# EAGLE design DraginoGateway2 (EAGLE 5.11)
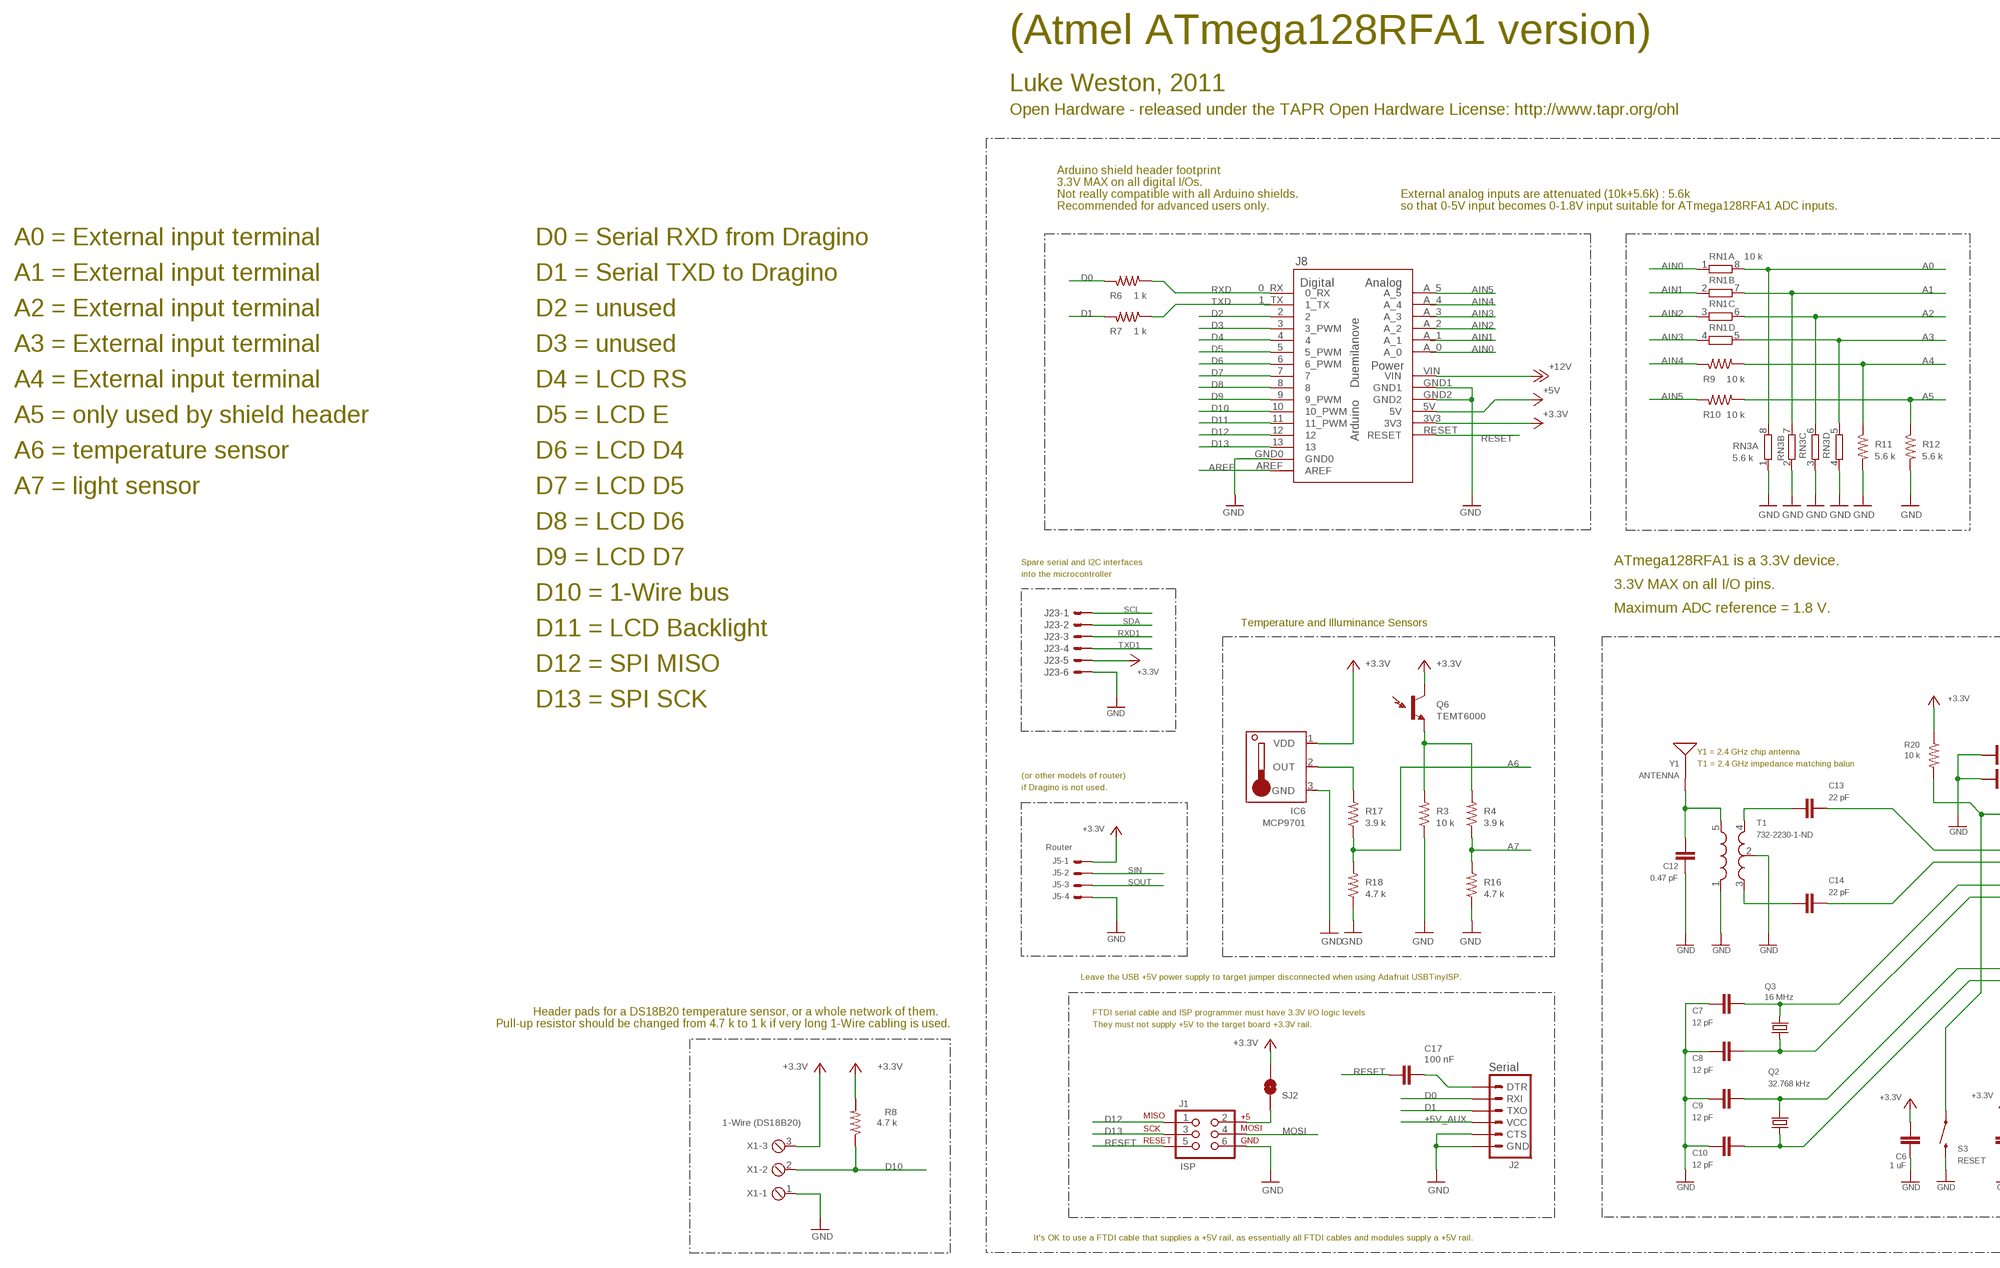
[diagram p0: schematic, sheet 1, part 1 of 2]
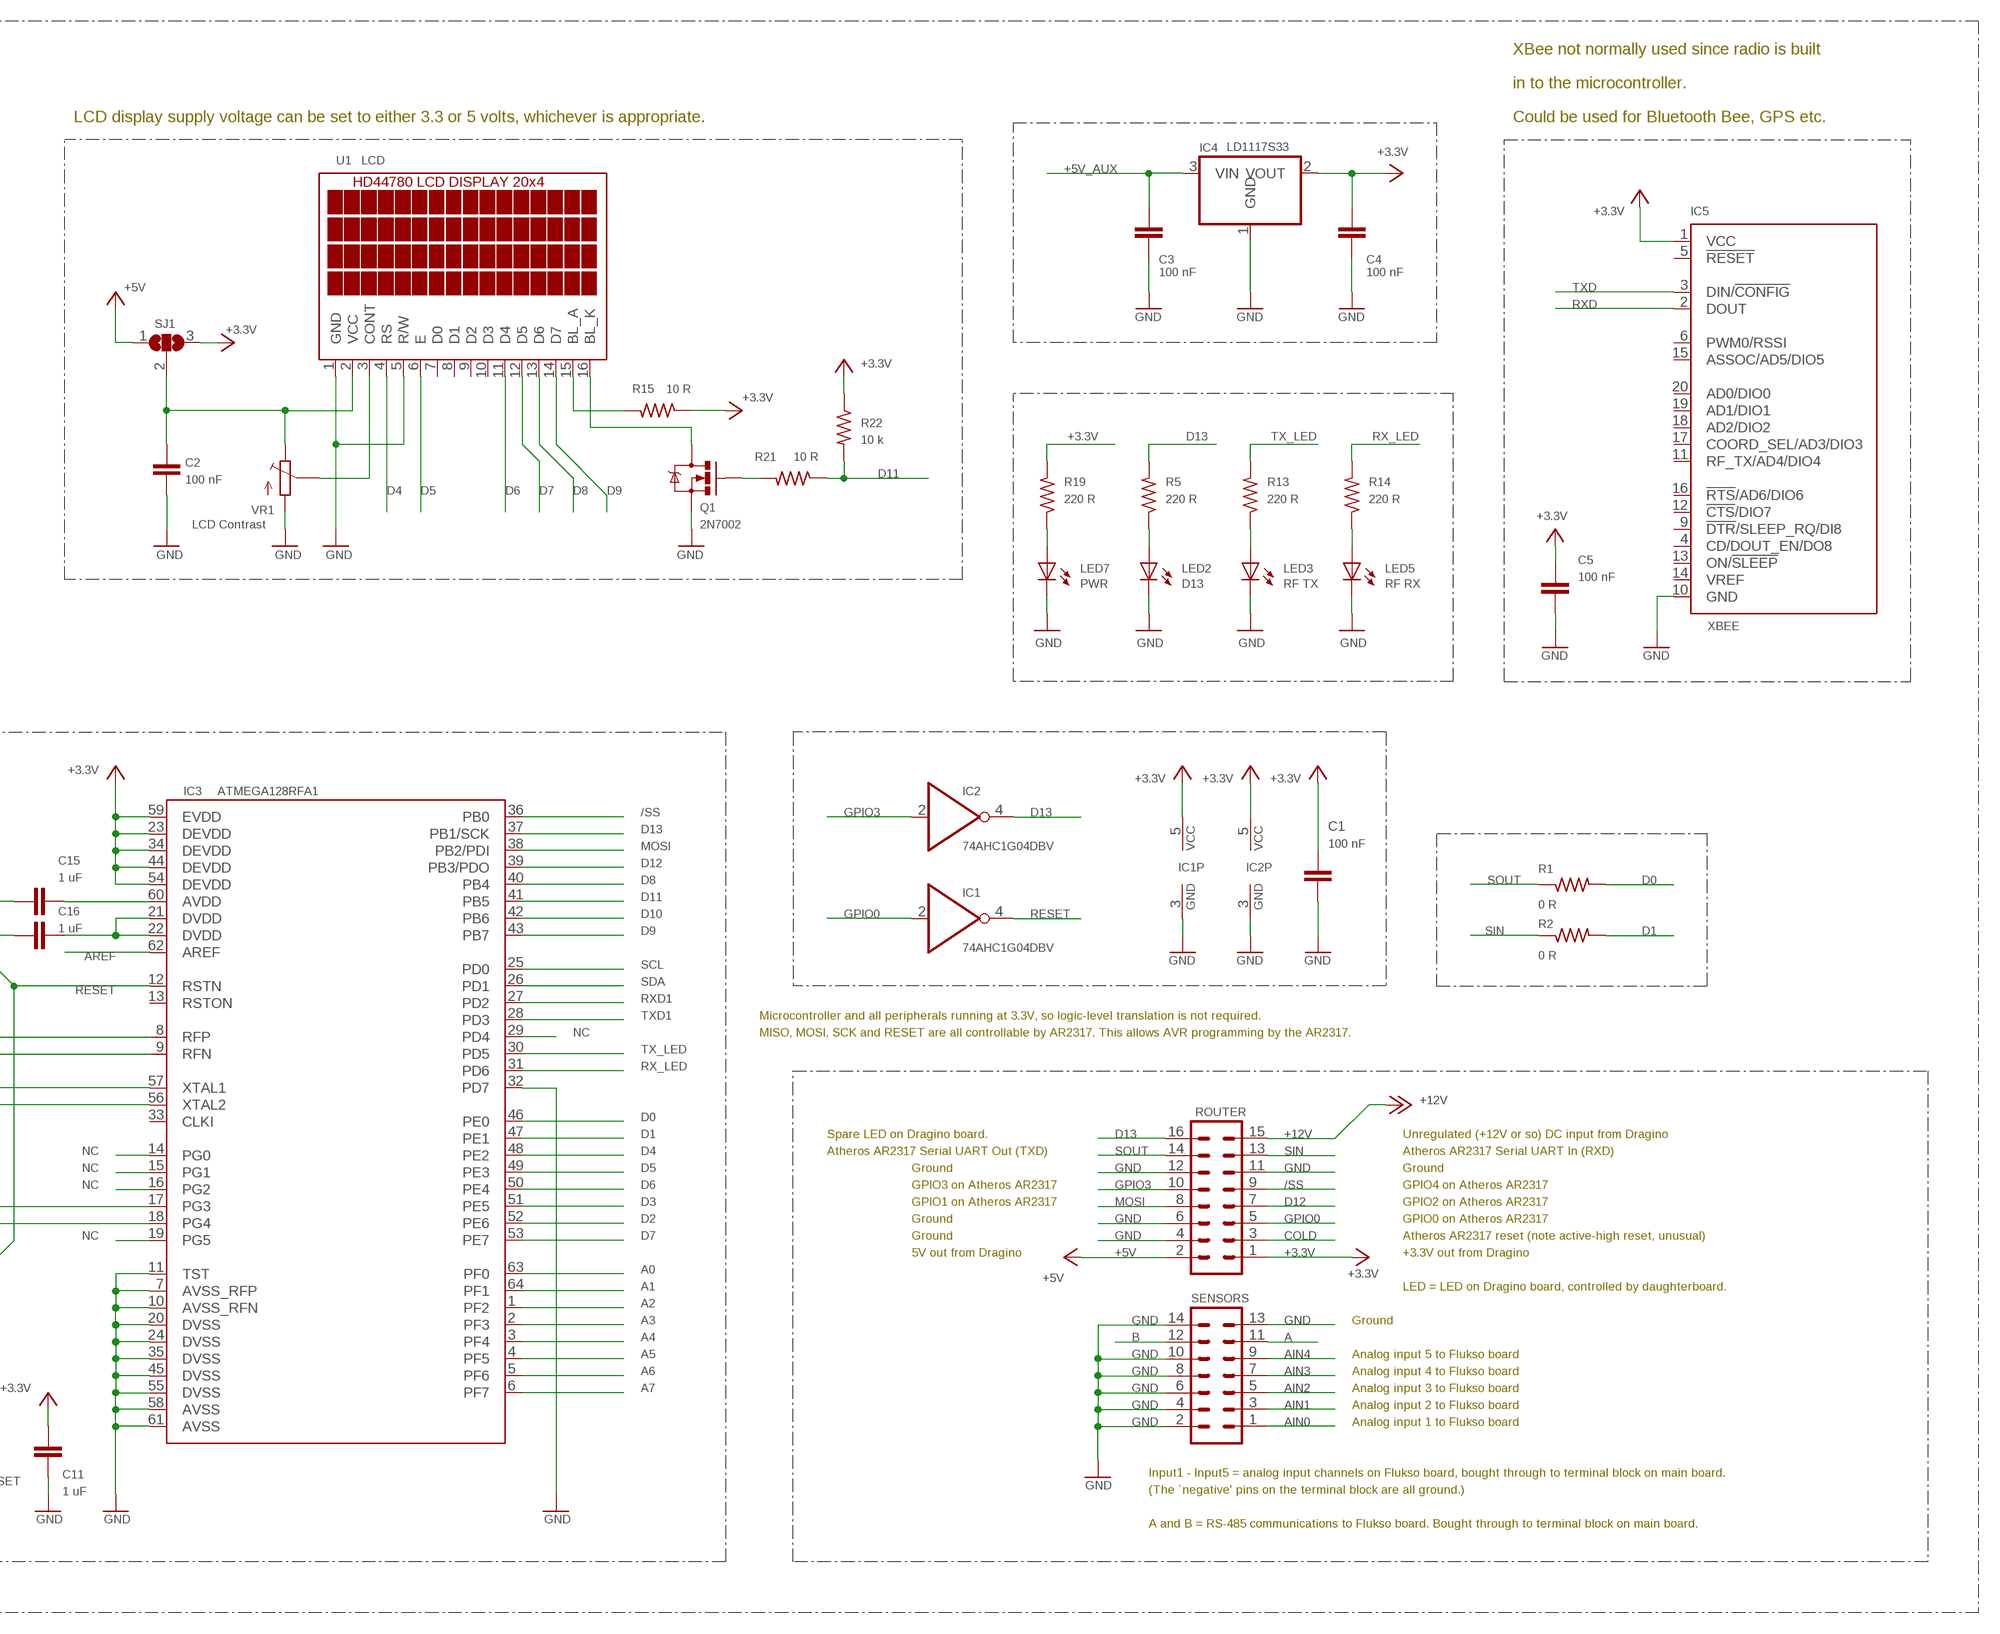
[diagram p1: schematic, sheet 1, part 2 of 2]

## Parts
C1  100 nF  C-EUC0805K  [C0805K]
C2  100 nF  C-EUC0805K  [C0805K]
C3  100 nF  C-EUC0805K  [C0805K]
C4  100 nF  C-EUC0805K  [C0805K]
C5  100 nF  C-EUC0805K  [C0805K]
C6  1 uF  C-EUC0805K  [C0805K]
C7  12 pF  C-EUC0805K  [C0805K]
C8  12 pF  C-EUC0805K  [C0805K]
C9  12 pF  C-EUC0805K  [C0805K]
C10  12 pF  C-EUC0805K  [C0805K]
C11  1 uF  C-EUC0805K  [C0805K]
C12  0.47 pF  C-EUC0603K  [C0603K]
C13  22 pF  C-EUC0603K  [C0603K]
C14  22 pF  C-EUC0603K  [C0603K]
C15  1 uF  C-EUC0805K  [C0805K]
C16  1 uF  C-EUC0805K  [C0805K]
C17  100 nF  C-EUC0805K  [C0805K]
IC1  74AHC1G04DBV  [SOT23-5]
IC2  74AHC1G04DBV  [SOT23-5]
IC3  ATMEGA128RFA1  [QFN-64]
IC4  LD1117S33  REG1117  [SOT223]
IC5  XBEE  [XBEE-PRO]
IC6  MCP9701  MCP9700  [TO92]
J1  ISP  AVR_SPI_PRG_6PTH  [2X3]
J2  Serial  ARDUINO_SERIAL_PROGRAMSMD  [1X06-SMD]
J5  Router  22-23-2041  [22-23-2041]
J8  ARDUINO-USBNO-OUTLINE-NO-TEXT-OCTAGONAL  [NO-OUTLINE-OCTAGONAL-NOTEXT]
J23  22-23-2061  [22-23-2061]
LED2  D13  LEDCHIPLED_0805  [CHIPLED_0805]
LED3  RF TX  LEDCHIPLED_0805  [CHIPLED_0805]
LED5  RF RX  LEDCHIPLED_0805  [CHIPLED_0805]
LED7  PWR  LEDCHIPLED_0805  [CHIPLED_0805]
Q1  2N7002  MOSFET-NCHANNELSMD  [SOT23-3]
Q2  32.768 kHz  CRYSTAL32-SMD  [CRYSTAL-32KHZ-SMD]
Q3  16 MHz  CRYSTAL5X3  [CRYSTAL-SMD-5X3]
Q6  TEMT6000  [TEMT6000-SEN]
R1  0 R  R-US_0207/10  [0207/10]
R2  0 R  R-US_0207/10  [0207/10]
R3  10 k  R-US_R0805  [R0805]
R4  3.9 k  R-US_R0805  [R0805]
R5  220 R  R-US_R0805  [R0805]
R6  1 k  R-US_R0805  [R0805]
R7  1 k  R-US_R0805  [R0805]
R8  4.7 k  R-US_0207/10  [0207/10]
R9  10 k  R-US_R0805  [R0805]
R10  10 k  R-US_R0805  [R0805]
R11  5.6 k  R-US_R0805  [R0805]
R12  5.6 k  R-US_R0805  [R0805]
R13  220 R  R-US_R0805  [R0805]
R14  220 R  R-US_R0805  [R0805]
R15  10 R  R-US_R0805  [R0805]
R16  4.7 k  R-US_R0805  [R0805]
R17  3.9 k  R-US_R0805  [R0805]
R18  4.7 k  R-US_R0805  [R0805]
R19  220 R  R-US_R0805  [R0805]
R20  10 k  R-US_R0805  [R0805]
R21  10 R  R-US_R0805  [R0805]
R22  10 k  R-US_R0805  [R0805]
RN1  10 k  4R-NEXBS8V  [EXBS8V]
RN3  5.6 k  4R-NEXBS8V  [EXBS8V]
ROUTER  MA08-2  [MA08-2]
S3  RESET  SWITCH-MOMENTARY-2SMD  [TACTILE_SWITCH_SMD]
SENSORS  MA07-2  [MA07-2]
SJ1  SJ2W  [SJ_2]
SJ2  SJ  [SJ]
T1  732-2230-1-ND  BALUN0805  [BALUN]
U1  LCD  TUXGR_16X2_R2  [TUXGR_16X2_R2]
VR1  LCD Contrast  TRIM_EU-S63S  [S63S]
X1  1-Wire (DS18B20)  MPT3  [3POL254]
Y1  ANTENNA  ANTENNA2SMD5  [ANTENNA-CHIP5]

## Nets
+3.3V: C1.1 C4.1 C5.1 C6.2 C11.2 IC1.5(VCC) IC2.5(VCC) IC3.23(DEVDD) IC3.34(DEVDD) IC3.44(DEVDD) IC3.54(DEVDD) IC3.59(EVDD) IC4.2(VOUT) IC5.1(VCC) IC6.1(VDD) J5.1 J8.3V3 J23.5 Q6.COLLECTOR(C1) R8.2 R15.1 R19.2 R20.1 R22.1 ROUTER.1 SJ1.3 SJ2.2 X1.3
+5V: J8.5V ROUTER.2 SJ1.1
+5V_AUX: C3.1 IC4.3(VIN) J2.4(VCC)
+12V: J8.VIN ROUTER.15
/SS: IC3.36(PB0) ROUTER.9
A: SENSORS.11
A0: IC3.63(PF0) RN1.8 RN3.8
A1: IC3.64(PF1) RN1.7 RN3.7
A2: IC3.1(PF2) RN1.6 RN3.6
A3: IC3.2(PF3) RN1.5 RN3.5
A4: IC3.3(PF4) R9.1 R11.1
A5: IC3.4(PF5) R10.1 R12.1
A6: IC3.5(PF6) R17.1 R18.2
A7: IC3.6(PF7) R4.1 R16.2
AIN0: J8.A_0 RN1.1 SENSORS.1
AIN1: J8.A_1 RN1.2 SENSORS.3
AIN2: J8.A_2 RN1.3 SENSORS.5
AIN3: J8.A_3 RN1.4 SENSORS.7
AIN4: J8.A_4 R9.2 SENSORS.9
AIN5: J8.A_5 R10.2
AREF: IC3.62(AREF) J8.AREF
B: SENSORS.12
COLD: ROUTER.3
D0: IC3.46(PE0) J2.2(RXI) R1.2 R6.2
D1: IC3.47(PE1) J2.3(TXO) R2.2 R7.2
D2: IC3.52(PE6) J8.2
D3: IC3.51(PE5) J8.3(3_PWM)
D4: IC3.48(PE2) J8.4 U1.4(RS)
D5: IC3.49(PE3) J8.5(5_PWM) U1.6(E)
D6: IC3.50(PE4) J8.6(6_PWM) U1.11(D4)
D7: IC3.53(PE7) J8.7 U1.12(D5)
D8: IC3.40(PB4) J8.8 U1.13(D6)
D9: IC3.43(PB7) J8.9(9_PWM) U1.14(D7)
D10: IC3.42(PB6) J8.10(10_PWM) R8.1 X1.2
D11: IC3.41(PB5) J8.11(11_PWM) R21.1 R22.2
D12: IC3.39(PB3/PDO) J1.1 J8.12 ROUTER.7
D13: IC2.4(O) IC3.37(PB1/SCK) J1.3 J8.13 R5.2 ROUTER.16
GND: C1.2 C2.2 C3.2 C4.2 C5.2 C6.1 C7.2 C8.2 C9.2 C10.2 C11.1 C12.1 C15.2 C16.2 IC1.3(GND) IC2.3(GND) IC3.7(AVSS_RFP) IC3.10(AVSS_RFN) IC3.11(TST) IC3.20(DVSS) IC3.24(DVSS) IC3.32(PD7) IC3.35(DVSS) IC3.45(DVSS) IC3.55(DVSS) IC3.58(AVSS) IC3.61(AVSS) IC4.1(GND) IC5.10(GND) IC6.3(GND) J1.6 J2.5(CTS) J2.6(GND) J5.4 J8.GND0 J8.GND1 J8.GND2 J23.6 LED2.C LED3.C LED5.C LED7.C Q1.2(S) R3.1 R11.2 R12.2 R16.1 R18.1 RN3.1 RN3.2 RN3.3 RN3.4 ROUTER.4 ROUTER.6 ROUTER.11 ROUTER.12 S3.3 SENSORS.2 SENSORS.4 SENSORS.6 SENSORS.8 SENSORS.10 SENSORS.13 SENSORS.14 T1.1(IN) T1.2(GND) U1.1(GND) U1.5(R/W) VR1.A X1.1
GPIO0: IC1.2(I) ROUTER.5
GPIO3: IC2.2(I) ROUTER.10
MOSI: IC3.38(PB2/PDI) J1.4 ROUTER.8
N$1: U1.3(CONT) VR1.S
N$2: J1.2 SJ2.1
N$11: C13.2 T1.4(OUT2)
N$13: C2.1 SJ1.2 U1.2(VCC) VR1.E
N$15: Q6.EMITTER(E1) R3.2 R4.2
N$28: LED2.A R5.1
N$29: LED3.A R13.1
N$30: LED5.A R14.1
N$37: IC6.2(OUT) R17.2
N$118: C14.2 T1.3(OUT1)
N$119: C12.2 T1.5(GND) Y1.FEED(SIGNAL)
N$120: C14.1 IC3.9(RFN)
N$121: C13.1 IC3.8(RFP)
N$122: C8.1 IC3.56(XTAL2) Q3.1
N$123: Q1.1(G) R21.2
N$124: IC3.29(PD4)
N$125: C7.1 IC3.57(XTAL1) Q3.3
N$126: C9.1 IC3.17(PG3) Q2.X2
N$127: C10.1 IC3.18(PG4) Q2.X1
N$128: C16.1 IC3.21(DVDD) IC3.22(DVDD)
N$129: C15.1 IC3.60(AVDD)
N$130: IC3.19(PG5)
N$131: IC3.16(PG2)
N$132: IC3.15(PG1)
N$133: IC3.14(PG0)
N$135: Q1.3(D) U1.16(BL_K)
N$136: R15.2 U1.15(BL_A)
N$137: LED7.A R19.1
N$138: C17.1 J2.1(DTR)
RESET: C17.2 IC1.4(O) IC3.12(RSTN) J1.5 J8.RESET R20.2 S3.1
RX_LED: IC3.31(PD6) R14.2
RXD: IC5.2(DOUT) J8.0_RX R6.1
RXD1: IC3.27(PD2) J23.3
SCL: IC3.25(PD0) J23.1
SDA: IC3.26(PD1) J23.2
SIN: J5.2 R2.1 ROUTER.13
SOUT: J5.3 R1.1 ROUTER.14
TX_LED: IC3.30(PD5) R13.2
TXD: IC5.3(DIN/!CONFIG) J8.1_TX R7.1
TXD1: IC3.28(PD3) J23.4
Unconnected: IC3.13(RSTON) IC3.33(CLKI) IC5.4(CD/DOUT_EN/DO8) IC5.5(!RESET) IC5.6(PWM0/RSSI) IC5.9(!DTR!/SLEEP_RQ/DI8) IC5.11(RF_TX/AD4/DIO4) IC5.12(!CTS!/DIO7) IC5.13(ON/!SLEEP) IC5.14(VREF) IC5.15(ASSOC/AD5/DIO5) IC5.16(!RTS!/AD6/DIO6) IC5.17(COORD_SEL/AD3/DIO3) IC5.18(AD2/DIO2) IC5.19(AD1/DIO1) IC5.20(AD0/DIO0) U1.7(D0) U1.8(D1) U1.9(D2) U1.10(D3)

## Notes on the sheet
- Dragino Ethernet/802.11/802.15.4/Zigbee/6LoWPAN Internet-of-things gateway
- (Atmel ATmega128RFA1 version)
- Luke Weston, 2011
- Open Hardware - released under the TAPR Open Hardware License: http://www.tapr.org/ohl
- XBee not normally used since radio is built
- Arduino shield header footprint
- 3.3V MAX on all digital I/Os. | in to the microcontroller.
- Not really compatible with all Arduino shields. | External analog inputs are attenuated (10k+5.6k) : 5.6k
- Recommended for advanced users only. | so that 0-5V input becomes 0-1.8V input suitable for ATmega128RFA1 ADC inputs. | LCD display supply voltage can be set to either 3.3 or 5 volts, whichever is appropriate. | Could be used for Bluetooth Bee, GPS etc.
- A0 = External input terminal | D0 = Serial RXD from Dragino
- A1 = External input terminal | D1 = Serial TXD to Dragino
- A2 = External input terminal | D2 = unused
- A3 = External input terminal | D3 = unused
- A4 = External input terminal | D4 = LCD RS
- A5 = only used by shield header | D5 = LCD E
- A6 = temperature sensor | D6 = LCD D4
- A7 = light sensor | D7 = LCD D5
- D8 = LCD D6
- D9 = LCD D7 | Spare serial and I2C interfaces | ATmega128RFA1 is a 3.3V device.
- into the microcontroller
- 3.3V MAX on all I/O pins.
- D10 = 1-Wire bus
- Maximum ADC reference = 1.8 V.
- Temperature and Illuminance Sensors
- D11 = LCD Backlight
- D12 = SPI MISO
- D13 = SPI SCK
- Y1 = 2.4 GHz chip antenna
- T1 = 2.4 GHz impedance matching balun
- (or other models of router)
- if Dragino is not used.
- Microcontroller and all peripherals running at 3.3V, so logic-level translation is not required.
- NC | MISO, MOSI, SCK and RESET are all controllable by AR2317. This allows AVR programming by the AR2317.
- Spare LED on Dragino board. | Unregulated (+12V or so) DC input from Dragino
- NC | Atheros AR2317 Serial UART Out (TXD) | Atheros AR2317 Serial UART In (RXD)
- NC | Ground | Ground
- NC | GPIO3 on Atheros AR2317 | GPIO4 on Atheros AR2317
- GPIO1 on Atheros AR2317 | GPIO2 on Atheros AR2317
- Leave the USB +5V power supply to target jumper disconnected when using Adafruit USBTinyISP. | Ground | GPIO0 on Atheros AR2317
- NC | Ground | Atheros AR2317 reset (note active-high reset, unusual)
- 5V out from Dragino | +3.3V out from Dragino
- Header pads for a DS18B20 temperature sensor, or a whole network of them. | FTDI serial cable and ISP programmer must have 3.3V I/O logic levels
- Pull-up resistor should be changed from 4.7 k to 1 k if very long 1-Wire cabling is used. | They must not supply +5V to the target board +3.3V rail. | LED = LED on Dragino board, controlled by daughterboard.
- Ground
- Analog input 5 to Flukso board
- Analog input 4 to Flukso board
- Analog input 3 to Flukso board
- Analog input 2 to Flukso board
- Analog input 1 to Flukso board
- Input1 - Input5 = analog input channels on Flukso board, bought through to terminal block on main board.
- (The `negative' pins on the terminal block are all ground.)
- A and B = RS-485 communications to Flukso board. Bought through to terminal block on main board.
- It's OK to use a FTDI cable that supplies a +5V rail, as essentially all FTDI cables and modules supply a +5V rail.

## Library data of the parts
C1-C17 = rcl:C-EU: CAPACITOR, European symbol
IC1 IC2 = 74xx-little-de:74*1G04: INVERTER Gate
IC3 = SparkFun:ATMEGA128RFA1
IC4 = burr-brown:REG1117: 800mA and 1A Low Dropout (LDO) Positive Regulator 1.8V, 2.5V, 2.85V, 3.3V, 5V, and Adj; MPN: REG1117; OC_FARNELL: 1097566; OC_NEWARK: 14P6981
IC5 = Luke:XBEE
IC6 = Luke:MCP9700
J1 = SparkFun:AVR_SPI_PRG_6: AVR ISP 6 Pin This is the reduced ISP connector for AVR programming. Common on Arduino. This footprint will take up less PCB space and can be used with a 10-pin to 6-pin adapter such as SKU: BOB-08508
J2 = SparkFun:ARDUINO_SERIAL_PROGRAM
J5 = con-molex:22-23-2041: .100" (2.54mm) Center Header - 4 Pin; MF: MOLEX; MPN: 22-23-2041; OC_FARNELL: 1462920; OC_NEWARK: 38C0355
J8 = Arduino-Various:ARDUINO-USB: The Ardiuno Duemilanove Pinouts layoutet as a Bare Shield. v0.5 Also for Arduino Diecimila. This is designed as a Part and has no Outline in the Dimension Layer. The Outline, when present, is drawed at the tPlace / bPlace Layer. Library by Stephanie Lange, http://www.k-ita.de/~sl/
J23 = con-molex:22-23-2061: .100" (2.54mm) Center Header - 6 Pin; MF: MOLEX; MPN: 22-23-2061; OC_FARNELL: 1462922; OC_NEWARK: 27C1933
LED2 LED3 LED5 LED7 = led:LED: LED OSRAM: - CHIPLED LG R971, LG N971, LY N971, LG Q971, LY Q971, LO R971, LY R971 LH N974, LH R974 LS Q976, LO Q976, LY Q976 LO Q996 - Hyper CHIPLED LW Q18S LB Q993, LB Q99A, LB R99A - SideLED LS A670, LO A670, LY A670, LG A670, LP A670 LB A673, LV A673, LT A673, LW A673 LH A674 LY A675 LS A676, LA A676, LO A676, LY A676, LW A676 LS A679, LY A679, LG A679 - Hyper Micro SIDELED® LS Y876, LA Y876, LO Y876, LY Y876 LT Y87S - SmartLED LW L88C, LW L88S LB L89C, LB L89S, LG L890 LS L89K, LO L89K, LY L89K LS L896, LA L896, LO L896, LY L896 - TOPLED LS T670, LO T670, LY T670, LG T670, LP T670 LSG T670, LSP T670, LSY T670, LOP T670, LYG T670 LG T671, LOG T671, LSG T671 LB T673, LV T673, LT T673, LW T673 LH T674 LS T676, LA T676, LO T676, LY T676, LB T676, LH T676, LSB T676, LW T676 LB T67C, LV T67C, LT T67C, LS T67K, LO T67K, LY T67K, LW E67C LS E67B, LA E67B, LO E67B, LY E67B, LB E67C, LV E67C, LT E67C LW T67C LS T679, LY T679, LG T679 LS T770, LO T770, LY T770, LG T770, LP T770 LB T773, LV T773, LT T773, LW T773 LH T774 LS E675, LA E675, LY E675, LS T675 LS T776, LA T776, LO T776, LY T776, LB T776 LHGB T686 LT T68C, LB T68C - Hyper Mini TOPLED® LB M676 - Mini TOPLED Santana® LG M470 LS M47K, LO M47K, LY M47K Source: http://www.osram.convergy.de LUXEON: - LUMILED® LXK2-PW12-R00, LXK2-PW12-S00, LXK2-PW14-U00, LXK2-PW14-V00 LXK2-PM12-R00, LXK2-PM12-S00, LXK2-PM14-U00 LXK2-PE12-Q00, LXK2-PE12-R00, LXK2-PE12-S00, LXK2-PE14-T00, LXK2-PE14-U00 LXK2-PB12-K00, LXK2-PB12-L00, LXK2-PB12-M00, LXK2-PB14-N00, LXK2-PB14-P00, LXK2-PB14-Q00 LXK2-PR12-L00, LXK2-PR12-M00, LXK2-PR14-Q00, LXK2-PR14-R00 LXK2-PD12-Q00, LXK2-PD12-R00, LXK2-PD12-S00 LXK2-PH12-R00, LXK2-PH12-S00 LXK2-PL12-P00, LXK2-PL12-Q00, LXK2-PL12-R00 Source: www.luxeon.com KINGBRIGHT: KA-3528ASYC Source: www.kingbright.com
Q1 = freetronics-master-v1:MOSFET-NCHANNEL
Q2 Q3 = SparkFun:CRYSTAL: Crystals Various standard crystals. Proven footprints. Spark Fun Electronics SKU : COM-00534
Q6 = SparkFun:TEMT6000: Ambient Light Sensor Simple light detection sensor. Output varies with light intensity input. Spark Fun Electronics SKU : COM-08348
R1-R22 = rcl:R-US_: RESISTOR, American symbol
RN1 RN3 = resistor-dil:4R-N: Array Chip Resistor Source: RS Component / Phycomp; OC_FARNELL: unknown; OC_NEWARK: unknown
ROUTER = con-lstb:MA08-2: PIN HEADER; OC_FARNELL: unknown; OC_NEWARK: unknown
S3 = SparkFun:SWITCH-MOMENTARY-2
SENSORS = con-lstb:MA07-2: PIN HEADER; OC_FARNELL: unknown; OC_NEWARK: unknown
SJ1 = jumper:SJ2W: SMD solder JUMPER
SJ2 = jumper:SJ: SMD solder JUMPER
T1 = SparkFun:BALUN
U1 = display-lcd:TUXGR_16X2_R2: Tuxgraphics LCD display 16x2 characters reflective, without background light Source: tuxgr_12x2_r2.pdf; OC_FARNELL: unknown; OC_NEWARK: unknown
VR1 = pot:TRIM_EU-: POTENTIOMETER
X1 = con-phoenix-254:MPT3: PHOENIX CONNECTOR; OC_FARNELL: unknown; OC_NEWARK: unknown
Y1 = SparkFun:ANTENNA2: Antenna Single endded antenna. Common with smaller chip antennas. CHIP4 package is the GPS Chip Antenna SKU: GPS-08418. CHIP5 package is 2.4GHz chip antenna SKU: WRL-00144.

## Board
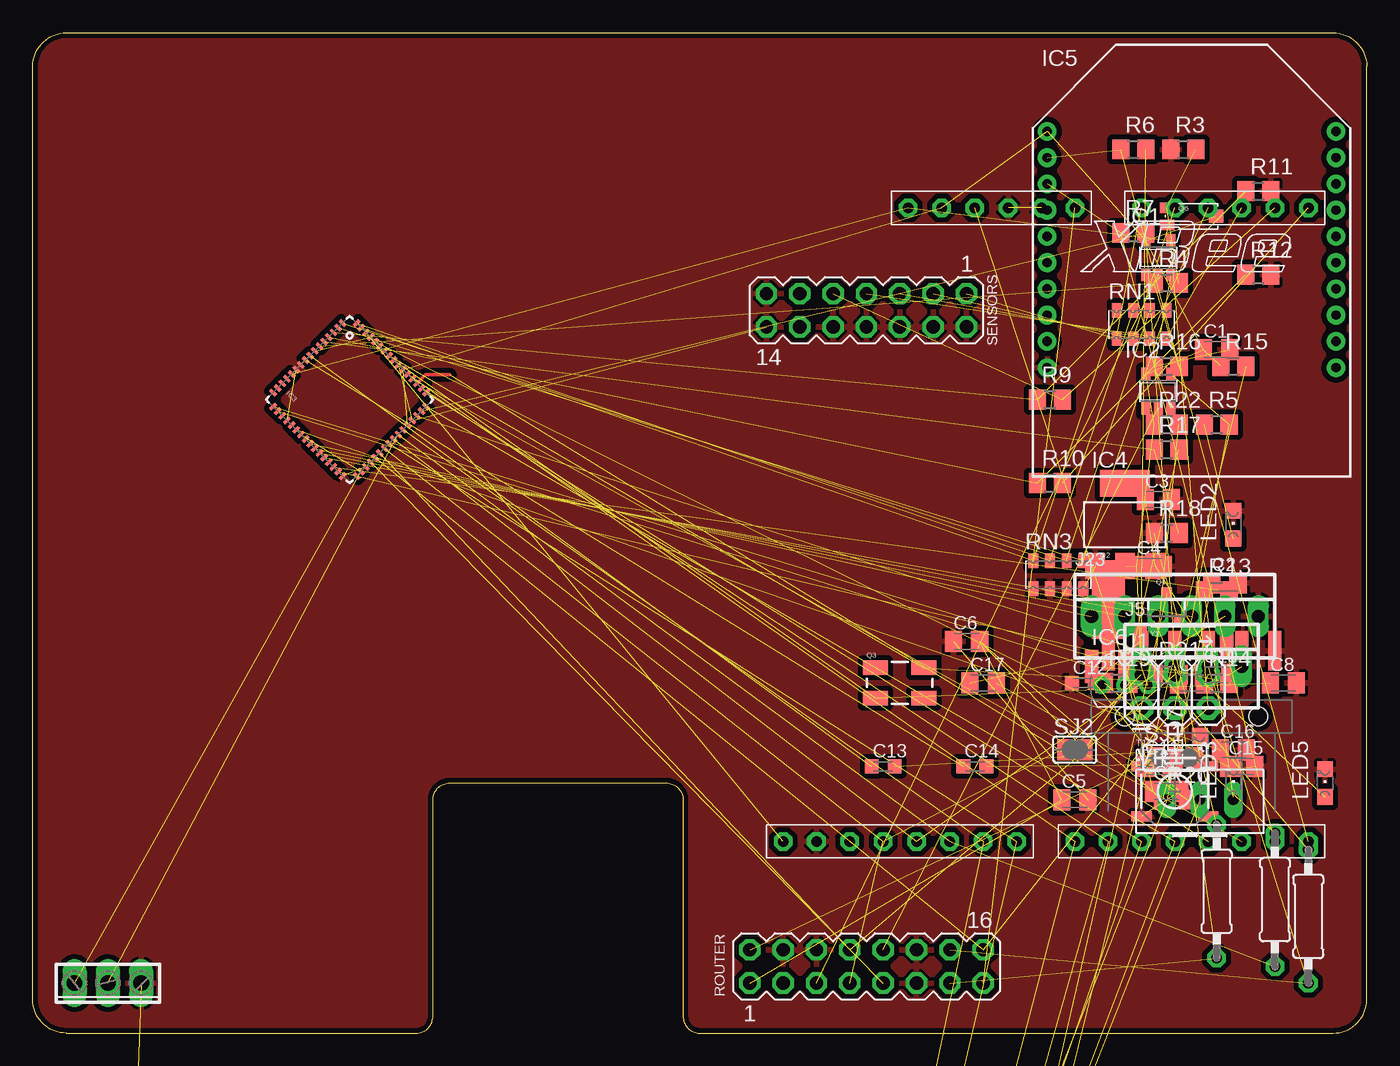
[diagram p2: board, top side]
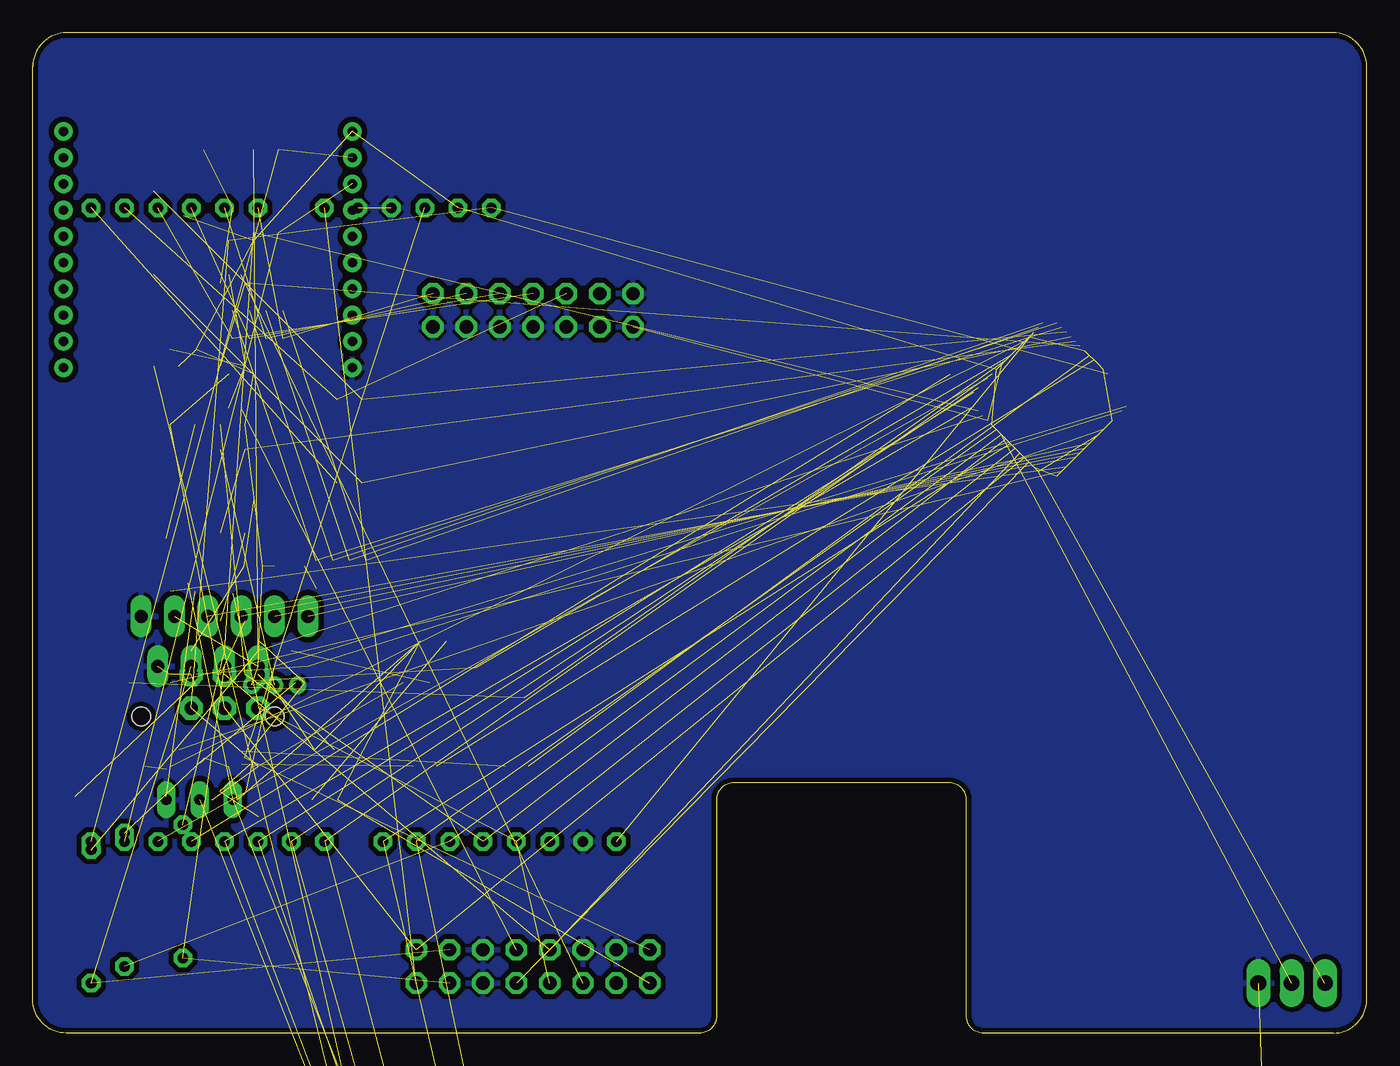
[diagram p3: board, bottom side, seen from below]

Size 101.6 x 76.2 mm. Coordinates in mm from the lower left corner, seen from the top.
Outline: 101.6,2.54 101.6,73.66 arc90 99.06,76.2 2.54,76.2 arc90 0,73.66 0,2.54 arc90 2.54,0 29.21,0 arc90 30.48,1.27 30.48,17.78 arc-90 31.75,19.05 48.26,19.05 arc-90 49.53,17.78 49.53,1.27 arc90 50.8,0 99.06,0 arc90 101.6,2.54
Copper layers (1*16): Top 0.035mm / dielectric 1.5mm / Bottom 0.035mm
Design rules "SparkFun.drc": minimum track width 8mil, minimum drill 20mil, track to track 8mil, track to pad 8mil, pad to pad 8mil, via to via 8mil, smd to smd 8mil, copper to edge 10mil, drill to drill 8mil, minimum pad ring 12mil, minimum via ring 10mil, stop-mask expansion 4mil, vias tented up to drill 25mil, thermal gap 10mil

### Footprints (pad centres in the part's own frame; a part is rotated, then mirrored left to right if it is on the bottom)
C0805K = smd 1.3 x 1.6: 1 -1,0; 2 1,0
C0603K = smd 1.05 x 1.08: 1 -0.875,0; 2 0.875,0
SOT23-5 = smd 0.69 x 0.99: 1 -0.95,-1.29; 2 0,-1.29; 3 0.95,-1.29; 4 0.95,1.3; 5 -0.95,1.3
QFN-64 = smd 0.6 x 0.25: 1 -4.5,3.75; 2 -4.5,3.25; 3 -4.5,2.75; 4 -4.5,2.25; 5 -4.5,1.75; 6 -4.5,1.25; 7 -4.5,0.75; 8 -4.5,0.25; 9 -4.5,-0.25; 10 -4.5,-0.75; 11 -4.5,-1.25; 12 -4.5,-1.75; 13 -4.5,-2.25; 14 -4.5,-2.75; 15 -4.5,-3.25; 16 -4.5,-3.75; 33 4.5,-3.75; 34 4.5,-3.25; 35 4.5,-2.75; 36 4.5,-2.25; 37 4.5,-1.75; 38 4.5,-1.25; 39 4.5,-0.75; 40 4.5,-0.25; 41 4.5,0.25; 42 4.5,0.75; 43 4.5,1.25; 44 4.5,1.75; 45 4.5,2.25; 46 4.5,2.75; 47 4.5,3.25; 48 4.5,3.75 | smd 0.25 x 0.6: 17 -3.75,-4.5; 18 -3.25,-4.5; 19 -2.75,-4.5; 20 -2.25,-4.5; 21 -1.75,-4.5; 22 -1.25,-4.5; 23 -0.75,-4.5; 24 -0.25,-4.5; 25 0.25,-4.5; 26 0.75,-4.5; 27 1.25,-4.5; 28 1.75,-4.5; 29 2.25,-4.5; 30 2.75,-4.5; 31 3.25,-4.5; 32 3.75,-4.5; 49 3.75,4.5; 50 3.25,4.5; 51 2.75,4.5; 52 2.25,4.5; 53 1.75,4.5; 54 1.25,4.5; 55 0.75,4.5; 56 0.25,4.5; 57 -0.25,4.5; 58 -0.75,4.5; 59 -1.25,4.5; 60 -1.75,4.5; 61 -2.25,4.5; 62 -2.75,4.5; 63 -3.25,4.5; 64 -3.75,4.5
SOT223 = smd 1.499 x 2.007: 1 -2.261,-3.15; 2 0.025,-3.15; 3 2.311,-3.15 | smd 3.81 x 2.007: 4 0,3.15
XBEE-PRO = drill 0.7 pad 1.422 round: 1 -11,10.27; 2 -11,8.27; 3 -11,6.27; 4 -11,4.27; 5 -11,2.27; 6 -11,0.27; 7 -11,-1.73; 8 -11,-3.73; 9 -11,-5.73; 10 -11,-7.73; 11 11,-7.73; 12 11,-5.73; 13 11,-3.73; 14 11,-1.73; 15 11,0.27; 16 11,2.27; 17 11,4.27; 18 11,6.27; 19 11,8.27; 20 11,10.27
TO92 = drill 0.7 pad 1.27 round: 1 1.746,-0.159; 2 0,-0.159; 3 -1.746,-0.159
2X3 = drill 1.016 pad 1.778 octagon: 1 0,0; 3 2.54,0; 4 2.54,2.54; 5 5.08,0; 6 5.08,2.54 | drill 1 pad 1.778 octagon: 2 0,2.54
1X06-SMD = smd 1 x 3: 1 -6.35,5; 2 -3.81,5; 3 -1.27,5; 4 1.27,5; 5 3.81,5; 6 6.35,5 | hole 1.4: -5.08,0; 5.08,0
22-23-2041 = drill 1 long: 1 -3.81,0; 2 -1.27,0; 3 1.27,0; 4 3.81,0
NO-OUTLINE-OCTAGONAL-NOTEXT = drill 0.8 pad 1.27 octagon: 0_RX -25.4,27.94; 1_TX -25.4,25.4; 2 -25.4,22.86; 3 -25.4,20.32; 3V3 22.86,0; 4 -25.4,17.78; 5 -25.4,15.24; 5V 22.86,2.54; 6 -25.4,12.7; 7 -25.4,10.16; 8 -25.4,5.715; 9 -25.4,3.175; 10 -25.4,0.635; 11 -25.4,-1.905; 12 -25.4,-4.445; 13 -25.4,-6.985; A_0 22.86,15.24; A_1 22.86,17.78; A_2 22.86,20.32; A_3 22.86,22.86; A_4 22.86,25.4; A_5 22.86,27.94; AREF -25.4,-12.065; GND0 -25.4,-9.525; GND1 22.86,7.62; GND2 22.86,5.08; RESET 22.86,-2.54; VIN 22.86,10.16
22-23-2061 = drill 1 long: 1 -6.35,0; 2 -3.81,0; 3 -1.27,0; 4 1.27,0; 5 3.81,0; 6 6.35,0
CHIPLED_0805 = smd 1.2 x 1.2: A 0,-1.05; C 0,1.05
SOT23-3 = smd 0.8 x 0.9: 1 -0.95,-1; 2 0.95,-1; 3 0,1.1
CRYSTAL-32KHZ-SMD = smd 2.5 x 6: SHEILD 0,5.08 | smd 1 x 2.5: X1 -1.27,0; X2 1.27,0
CRYSTAL-SMD-5X3 = smd 1.9 x 1.1: 1 -1.85,-1.15; 2 1.85,-1.15; 3 1.85,1.15; 4 -1.85,1.15
TEMT6000-SEN = smd 1.1 x 0.8: BASE -1.87,-0.65; EMITTER -1.87,0.65 | smd 1.1 x 1: COLLECTOR 1.86,0.01
0207/10 = drill 0.813 octagon: 1 -5.08,0; 2 5.08,0
R0805 = smd 1.3 x 1.5: 1 -0.95,0; 2 0.95,0
EXBS8V = smd 0.75 x 1.1: 1 -1.905,-1.07; 2 -0.635,-1.07; 3 0.635,-1.07; 4 1.905,-1.07; 5 1.905,1.07; 6 0.635,1.07; 7 -0.635,1.07; 8 -1.905,1.07
MA08-2 = drill 1.016 octagon: 1 -8.89,-1.27; 2 -8.89,1.27; 3 -6.35,-1.27; 4 -6.35,1.27; 5 -3.81,-1.27; 6 -3.81,1.27; 7 -1.27,-1.27; 8 -1.27,1.27; 9 1.27,-1.27; 10 1.27,1.27; 11 3.81,-1.27; 12 3.81,1.27; 13 6.35,-1.27; 14 6.35,1.27; 15 8.89,-1.27; 16 8.89,1.27
TACTILE_SWITCH_SMD = smd 1.524 x 0.762: 1 -2.54,1.905; 2 2.54,1.905; 3 -2.54,-1.905; 4 2.54,-1.905
MA07-2 = drill 1.016 octagon: 1 -7.62,-1.27; 2 -7.62,1.27; 3 -5.08,-1.27; 4 -5.08,1.27; 5 -2.54,-1.27; 6 -2.54,1.27; 7 0,-1.27; 8 0,1.27; 9 2.54,-1.27; 10 2.54,1.27; 11 5.08,-1.27; 12 5.08,1.27; 13 7.62,-1.27; 14 7.62,1.27
SJ_2 = smd 1.168 x 1.6: 1 -1.524,0; 2 0,0; 3 1.524,0
SJ = smd 1.168 x 1.6: 1 -0.762,0; 2 0.762,0
BALUN = smd 0.27 x 0.4: 1 -0.7,-0.5; 2 -0.05,-0.5; 3 0.6,-0.5; 4 0.6,0.5; 5 -0.05,0.5; 6 -0.7,0.5
TUXGR_16X2_R2 = drill 1 pad 1.676 round: 1 -32,15.5; 2 -29.46,15.5; 3 -26.92,15.5; 4 -24.38,15.5; 5 -21.84,15.5; 6 -19.3,15.5; 7 -16.76,15.5; 8 -14.22,15.5; 9 -11.68,15.5; 10 -9.14,15.5; 11 -6.6,15.5; 12 -4.06,15.5; 13 -1.52,15.5; 14 1.02,15.5; 15 3.56,15.5; 16 6.1,15.5 | hole 2.5: -37.5,-15.5; 37.5,-15.5; -37.5,15.5; 37.5,15.5
S63S = drill 0.813 long: A 2.54,0; E -2.54,0; S 0,0
3POL254 = drill 1.2 long: 1 -2.54,0; 2 0,0; 3 2.54,0
ANTENNA-CHIP5 = smd 1.016 x 2.54: FEED -3.302,0; NC 3.302,0

### Placement (x,y rotation side)
C1  90.17,52.07 0 top
C2  90.81,34.29 0 top
C3  85.73,40.64 0 top
C4  85.09,35.56 0 top
C5  79.38,17.78 0 top
C6  71.12,29.84 0 top
C7  88.27,26.67 0 top
C8  95.25,26.67 0 top
C9  86.36,18.41 0 top
C10  90.17,27.3 0 top
C11  85.73,20.32 0 top
C12  80.01,26.67 0 top
C13  64.77,20.32 0 top
C14  71.76,20.32 0 top
C15  92.08,20.32 0 top
C16  91.44,21.59 0 top
C17  72.39,26.67 0 top
IC1  85.73,59.05 0 top
IC2  85.73,48.9 0 top
IC3  24.13,48.26 315 top
IC4  83.19,38.73 0 top
IC5  88.27,58.42 0 top
IC6  83.19,26.67 0 top
J1  84.45,24.77 0 top
J2  88.27,24.13 0 top
J5  88.27,27.94 0 top
J8  69.22,40.01 90 bottom
J23  87,31.75 0 top
LED2  91.44,38.73 0 top
LED3  91.44,19.05 0 top
LED5  98.42,19.05 0 top
LED7  88.9,21.59 0 top
Q1  86.36,32.38 0 top
Q2  81.92,27.94 0 top
Q3  66.04,26.67 0 top
Q6  88.27,62.23 0 top
R1  97.16,8.89 90 top
R2  90.17,10.79 90 top
R3  87.63,67.31 0 top
R4  86.36,57.15 0 top
R5  90.17,46.35 0 top
R6  83.82,67.31 0 top
R7  83.82,60.96 0 top
R8  94.62,10.16 90 top
R9  77.47,48.26 0 top
R10  77.47,41.91 0 top
R11  93.34,64.14 0 top
R12  93.34,57.78 0 top
R13  90.17,33.66 0 top
R14  90.17,26.67 0 top
R15  91.44,50.8 0 top
R16  86.36,50.8 0 top
R17  86.36,44.45 0 top
R18  86.36,38.1 0 top
R19  82.55,26.67 0 top
R20  87,17.78 0 top
R21  86.36,27.3 0 top
R22  86.36,46.35 0 top
RN1  84.45,53.98 0 top
RN3  78.11,34.92 0 top
ROUTER  63.5,5.08 0 top
S3  87,18.41 0 top
SENSORS  63.5,55.07 180 top
SJ1  87,20.95 0 top
SJ2  79.38,21.59 0 top
T1  85.09,20.95 0 top
U1  22.23,-234.95 0 top  (outside the outline)
VR1  88.9,17.78 0 top
X1  5.71,3.81 180 top
Y1  87.63,29.84 0 top

### Tracks (layer width: path | path; a pad name or v marks a point on that pad's centre or on a via)
+3.3V  (27 unrouted)
+5V  (2 unrouted)
+5V_AUX  (2 unrouted)
+12V  (1 unrouted)
/SS  (1 unrouted)
A0  (2 unrouted)
A1  (2 unrouted)
A2  (2 unrouted)
A3  (2 unrouted)
A4  (2 unrouted)
A5  (2 unrouted)
A6  (2 unrouted)
A7  (2 unrouted)
AIN0  (2 unrouted)
AIN1  (2 unrouted)
AIN2  (2 unrouted)
AIN3  (2 unrouted)
AIN4  (2 unrouted)
AIN5  (1 unrouted)
AREF  (1 unrouted)
D0  (3 unrouted)
D1  (3 unrouted)
D2  (1 unrouted)
D3  (1 unrouted)
  Top 0.254: IC3.51 29.92,50.16 31.75,50.16
D4  (2 unrouted)
D5  (2 unrouted)
D6  (2 unrouted)
D7  (2 unrouted)
D8  (2 unrouted)
D9  (2 unrouted)
D10  (3 unrouted)
D11  (3 unrouted)
D12  (3 unrouted)
D13  (5 unrouted)
GND  (29 unrouted)
  pour Bottom (isolate 0.406): -1.27,77.47 102.87,77.47 102.87,-1.27 -1.27,-1.27
  pour Top (isolate 0.406): -2.54,78.74 104.14,78.74 104.14,-2.54 -2.54,-2.54
GPIO0  (1 unrouted)
GPIO3  (1 unrouted)
MOSI  (2 unrouted)
N$1  (1 unrouted)
N$2  (1 unrouted)
N$11  (1 unrouted)
N$13  (3 unrouted)
N$15  (2 unrouted)
N$28  (1 unrouted)
N$29  (1 unrouted)
N$30  (1 unrouted)
N$37  (1 unrouted)
N$118  (1 unrouted)
N$119  (2 unrouted)
N$120  (1 unrouted)
N$121  (1 unrouted)
N$122  (2 unrouted)
N$123  (1 unrouted)
N$125  (2 unrouted)
N$126  (2 unrouted)
N$127  (2 unrouted)
N$128  (2 unrouted)
N$129  (1 unrouted)
N$135  (1 unrouted)
N$136  (1 unrouted)
N$137  (1 unrouted)
N$138  (1 unrouted)
RESET  (6 unrouted)
RX_LED  (1 unrouted)
RXD  (2 unrouted)
RXD1  (1 unrouted)
SCL  (1 unrouted)
SDA  (1 unrouted)
SIN  (2 unrouted)
SOUT  (2 unrouted)
TX_LED  (1 unrouted)
TXD  (2 unrouted)
TXD1  (1 unrouted)

### Text on the board
Document: RESET | +3.3V | +5V | GND | GND | +12V | A0 | A1 | A2 | A3 | A4 | A5